# EAGLE schematic schematic (EAGLE 7.7.0)
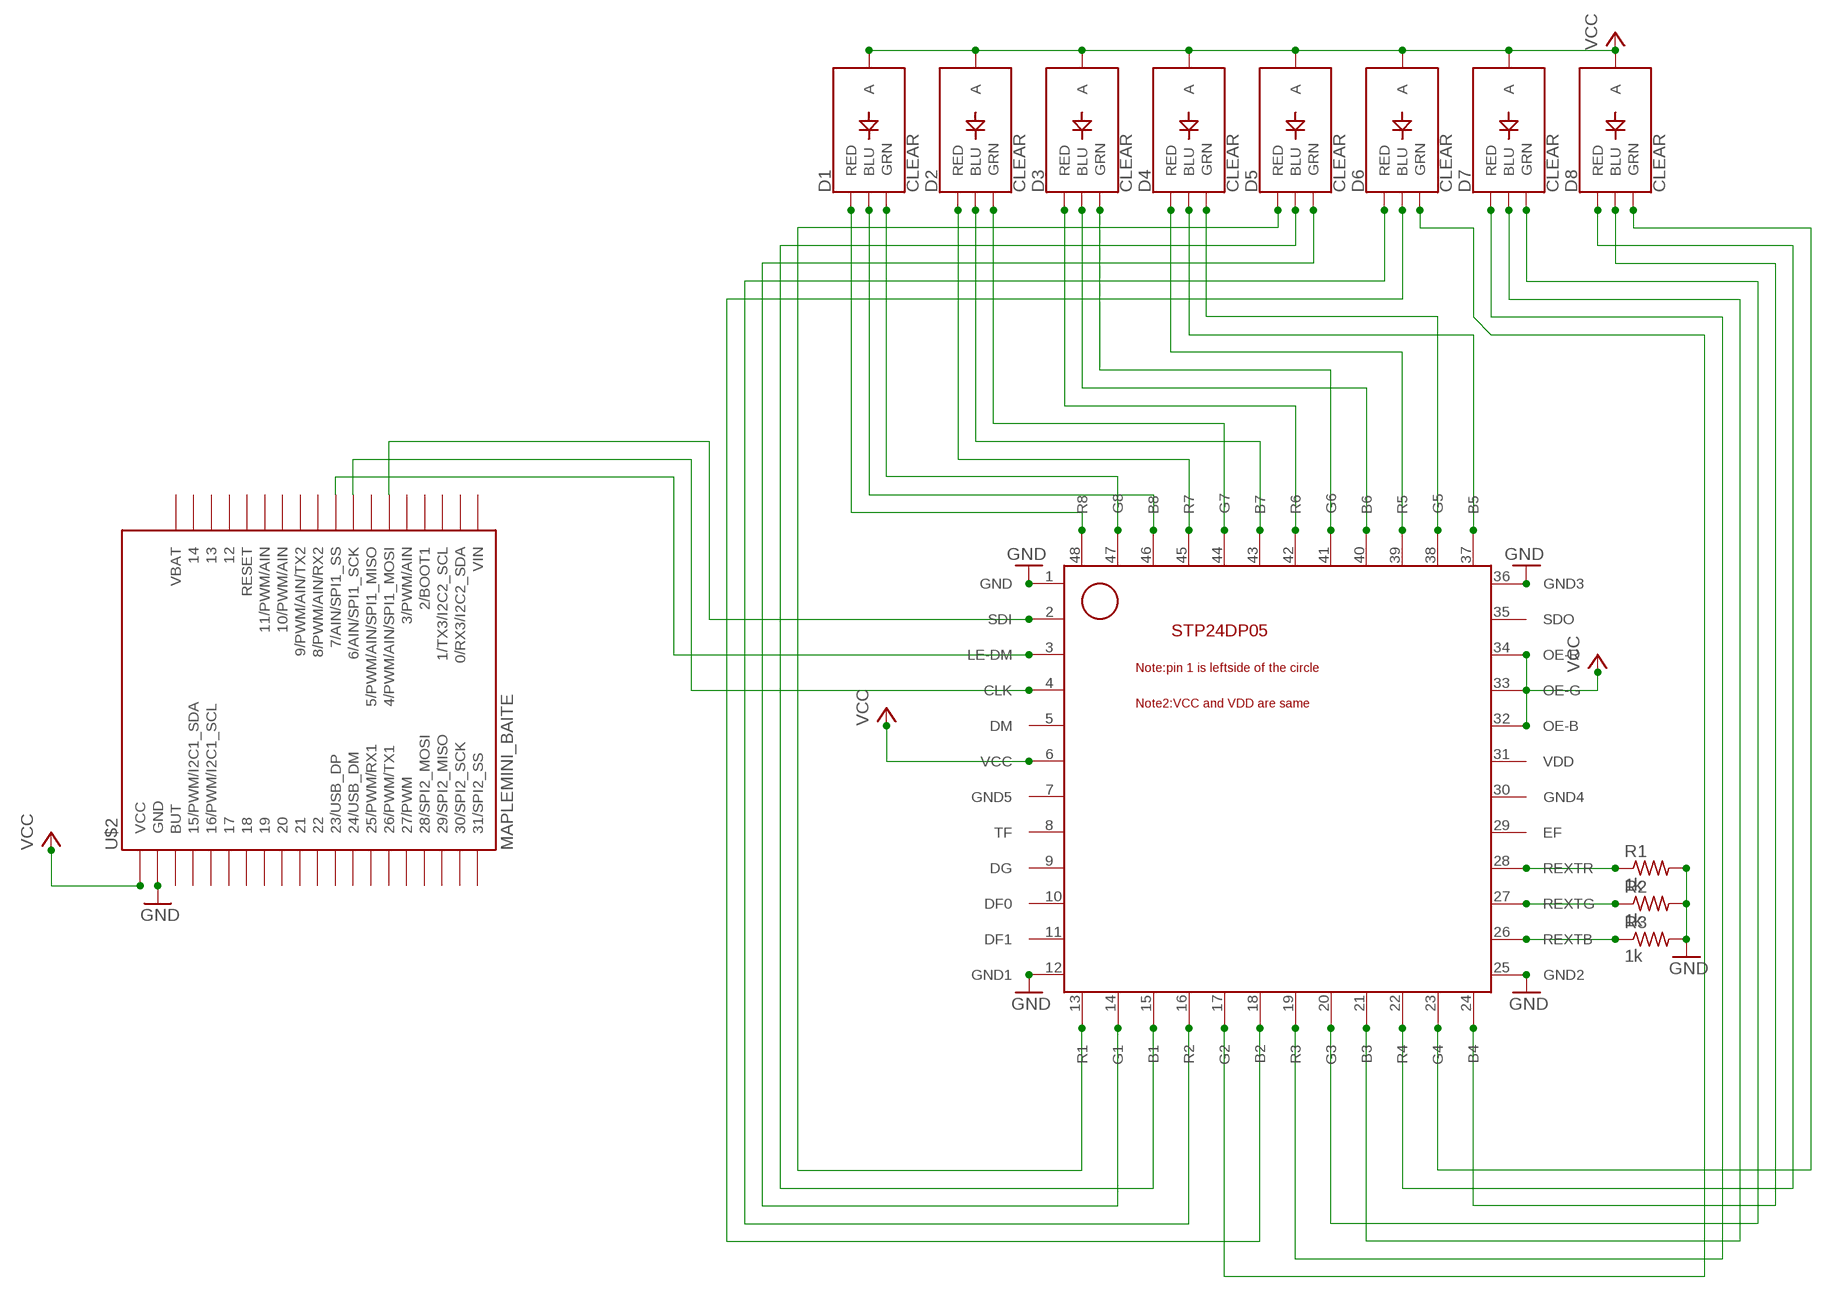
[diagram p0: schematic, sheet 1]

## Parts
D1  CLEAR  LED-RGB-CACLEAR  [LED-RGB-THRU]
D2  CLEAR  LED-RGB-CACLEAR  [LED-RGB-THRU]
D3  CLEAR  LED-RGB-CACLEAR  [LED-RGB-THRU]
D4  CLEAR  LED-RGB-CACLEAR  [LED-RGB-THRU]
D5  CLEAR  LED-RGB-CACLEAR  [LED-RGB-THRU]
D6  CLEAR  LED-RGB-CACLEAR  [LED-RGB-THRU]
D7  CLEAR  LED-RGB-CACLEAR  [LED-RGB-THRU]
D8  CLEAR  LED-RGB-CACLEAR  [LED-RGB-THRU]
R1  1k  R-US_0207/5V  [0207/5V]
R2  1k  R-US_0207/5V  [0207/5V]
R3  1k  R-US_0207/5V  [0207/5V]
U$1  STP24DP05  [TQFP48]
U$2  MAPLEMINI_BAITE  [MAPLEMINI_LEAF]

## Nets
GND: R1.2 R2.2 R3.2 U$2.2(GND) U$2.39(GND)
N$1: D1.1(RED)
N$2: D1.4(BLU)
N$3: D1.3(GRN)
N$4: D2.1(RED)
N$5: D2.4(BLU)
N$6: D2.3(GRN)
N$7: D3.1(RED)
N$8: D3.4(BLU)
N$9: D3.3(GRN)
N$10: D4.1(RED)
N$11: D4.4(BLU)
N$12: D4.3(GRN)
N$13: D5.1(RED)
N$14: D5.4(BLU)
N$15: D5.3(GRN)
N$16: D6.1(RED)
N$17: D6.4(BLU)
N$18: D8.3(GRN)
N$19: D8.1(RED)
N$20: D8.4(BLU)
N$21: D7.3(GRN)
N$22: D7.4(BLU)
N$23: D7.1(RED)
N$24: D6.3(GRN)
N$25: R1.1
N$26: R2.1
N$27: R3.1
N$28: U$2.26(4/PWM/AIN/SPI1_MOSI)
N$29: U$2.28(6/AIN/SPI1_SCK)
N$30: U$2.29(7/AIN/SPI1_SS)
VCC: D1.2(A) D2.2(A) D3.2(A) D4.2(A) D5.2(A) D6.2(A) D7.2(A) D8.2(A) U$2.1(VCC) U$2.40(VCC)
Unconnected: U$1.1(GND) U$1.2(SDI) U$1.3(LE-DM) U$1.4(CLK) U$1.5(DM) U$1.6(VCC) U$1.7(GND5) U$1.8(TF) U$1.9(DG) U$1.10(DF0) U$1.11(DF1) U$1.12(GND1) U$1.13(R1) U$1.14(G1) U$1.15(B1) U$1.16(R2) U$1.17(G2) U$1.18(B2) U$1.19(R3) U$1.20(G3) U$1.21(B3) U$1.22(R4) U$1.23(G4) U$1.24(B4) U$1.25(GND2) U$1.26(REXTB) U$1.27(REXTG) U$1.28(REXTR) U$1.29(EF) U$1.30(GND4) U$1.31(VDD) U$1.32(OE-B) U$1.33(OE-G) U$1.34(OE-R) U$1.35(SDO) U$1.36(GND3) U$1.37(B5) U$1.38(G5) U$1.39(R5) U$1.40(B6) U$1.41(G6) U$1.42(R6) U$1.43(B7) U$1.44(G7) U$1.45(R7) U$1.46(B8) U$1.47(G8) U$1.48(R8) U$2.3(BUT) U$2.4(15/PWM/I2C1_SDA) U$2.5(16/PWM/I2C1_SCL) U$2.6 U$2.7 U$2.8 U$2.9 U$2.10 U$2.11 U$2.12(23/USB_DP) U$2.13(24/USB_DM) U$2.14(25/PWM/RX1) U$2.15(26/PWM/TX1) U$2.16(27/PWM) U$2.17(28/SPI2_MOSI) U$2.18(29/SPI2_MISO) U$2.19(30/SPI2_SCK) U$2.20(31/SPI2_SS) U$2.21(VIN) U$2.22(0/RX3/I2C2_SDA) U$2.23(1/TX3/I2C2_SCL) U$2.24(2/BOOT1) U$2.25(3/PWM/AIN) U$2.27(5/PWM/AIN/SPI1_MISO) U$2.30(8/PWM/AIN/RX2) U$2.31(9/PWM/AIN/TX2) U$2.32(10/PWM/AIN) U$2.33(11/PWM/AIN) U$2.34(RESET) U$2.35 U$2.36 U$2.37 U$2.38(VBAT)

## Library data of the parts
D1-D8 = SparkFun-LED:LED-RGB-CA: LED-RGB Diffused Common Anode Packages: LED RGB-THRU P-LCC-4-3 LED-TRICOLOR-SMD SparkFun Products: RGB Diffused Common Anode- Diffuse <[https://www.sparkfun.com/products/10821]> RGB Diffused Common Anode - Clear <[https://www.sparkfun.com/products/10820]> Qduino Mini <[https://www.sparkfun.com/products/13614]> Triple Output LED RGB - SMD <https://www.sparkfun.com/products/7844>; PROD_ID: DIO-10631
R1-R3 = adafruit:R-US_: RESISTOR, American symbol
U$1 = stp24DP05:STP24DP05
U$2 = stm32duino boards:MAPLEMINI_BAITE